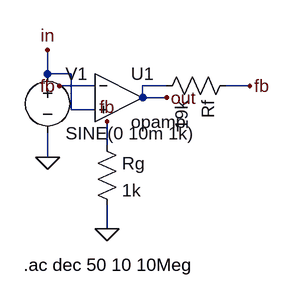
[diagram p0: schematic amp.asc]
amp.asc, the LTspice schematic file:
Version 4
SHEET 1 880 680
WIRE 128 80 128 48
WIRE 128 160 128 192
WIRE 192 128 160 128
WIRE 160 128 160 80
WIRE 160 80 128 80
WIRE 256 112 288 112
WIRE 288 96 256 96
WIRE 256 96 256 112
WIRE 368 96 400 96
WIRE 192 96 144 96
WIRE 208 176 208 144
WIRE 208 256 208 288
FLAG 128 48 in
FLAG 128 192 0
FLAG 288 112 out
FLAG 400 96 fb
FLAG 144 96 fb
FLAG 208 144 fb
FLAG 208 288 0
SYMBOL voltage 128 64 R0
SYMATTR InstName V1
SYMATTR Value SINE(0 10m 1k)
SYMATTR Value2 AC 1
SYMBOL OpAmps/opamp 224 48 R0
SYMATTR InstName U1
SYMATTR SpiceLine2 GBW=1Meg
SYMBOL res 384 80 R90
SYMATTR InstName Rf
SYMATTR Value 19k
SYMBOL res 192 160 R0
SYMATTR InstName Rg
SYMATTR Value 1k
TEXT 96 336 Left 2 !.ac dec 50 10 10Meg

The netlist it stands for:
* amp.asc
V1 in 0 SINE(0 10m 1k) AC 1
XU1 fb in out opamp Aol=100K GBW=1Meg  ; pins invin noninvin out
Rf fb out 19k
Rg fb 0 1k
.ac dec 50 10 10Meg
.backanno
.end